# EAGLE design lm25010 (EAGLE 8.1.0)
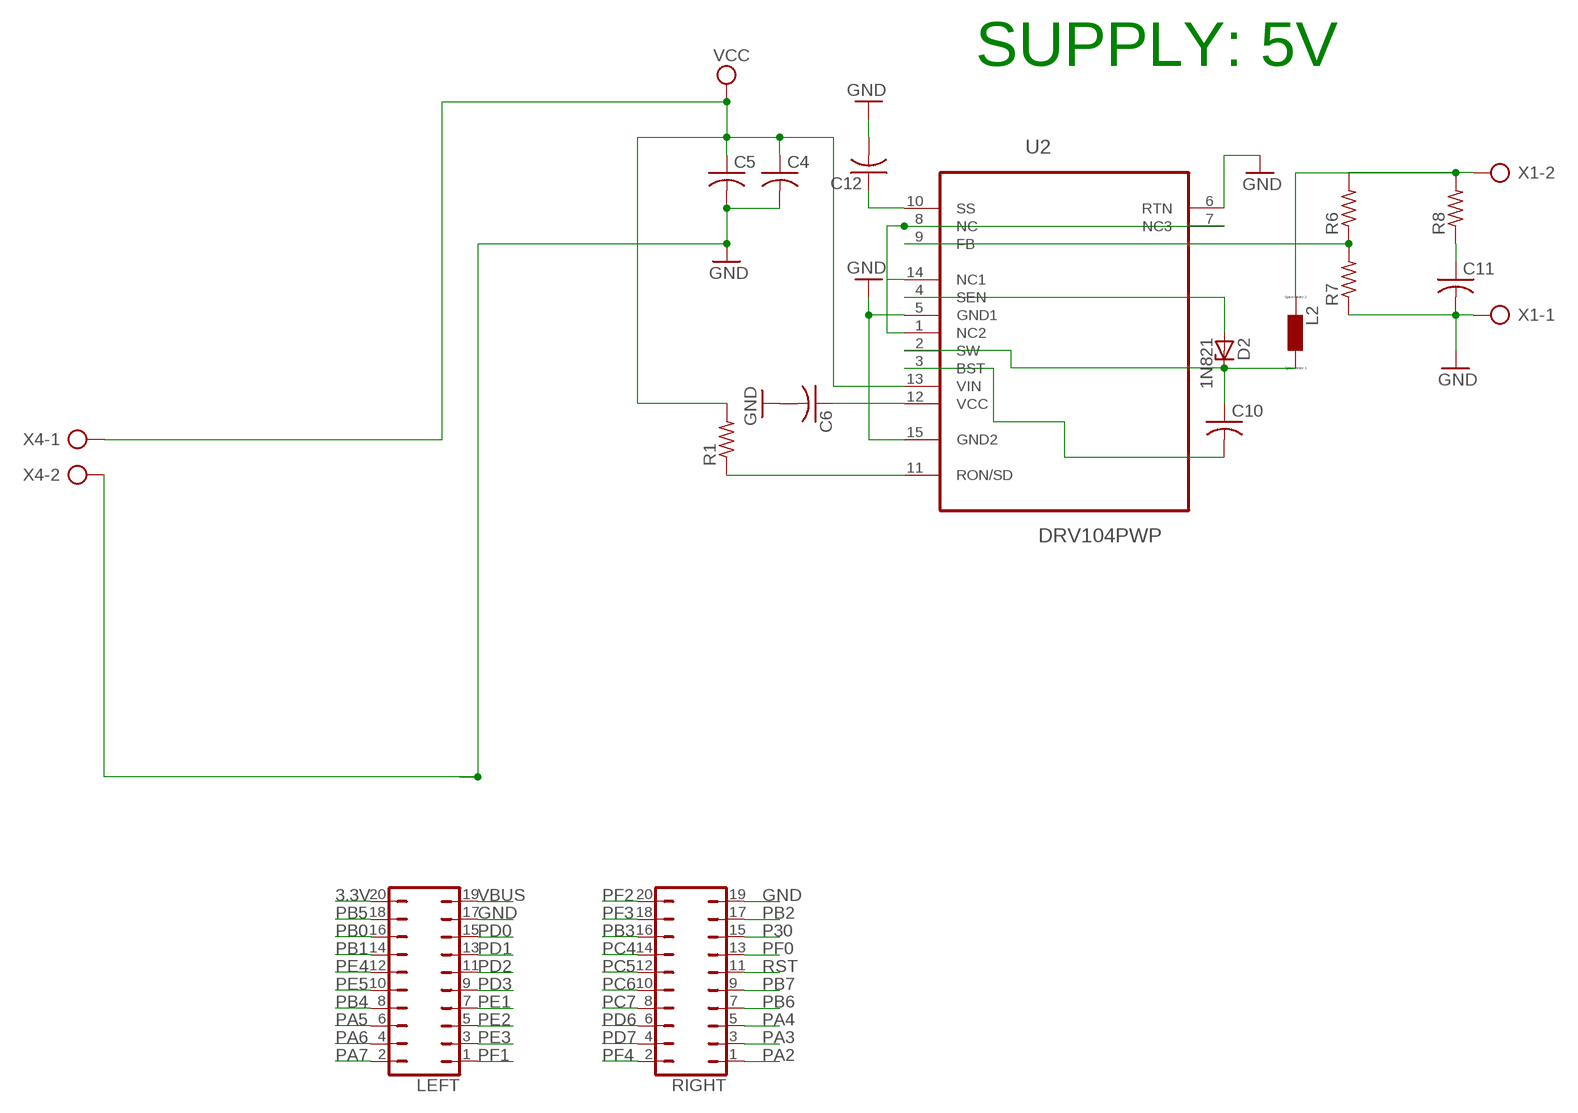
[diagram p0: schematic, sheet 1]

## Parts
C4  C-US025-024X044  [C025-024X044]
C5  C-US025-024X044  [C025-024X044]
C6  C-US025-024X044  [C025-024X044]
C10  C-US025-024X044  [C025-024X044]
C11  C-US025-024X044  [C025-024X044]
C12  C-US025-024X044  [C025-024X044]
D2  1N821  [DO35Z10]
L2  L0207/10  [0207/10]
LEFT  JP10Q  [JP10Q]
R1  R-US_0207/10  [0207/10]
R6  R-US_0207/10  [0207/10]
R7  R-US_0207/10  [0207/10]
R8  R-US_0207/10  [0207/10]
RIGHT  JP10Q  [JP10Q]
U2  DRV104PWP  [SOP65P640X120-15N]
X1  AK300/2  [AK300/2]
X4  AK300/2  [AK300/2]

## Nets
3.3V: LEFT.20
GND: C4.2 C5.2 C6.2 C11.2 C12.2 LEFT.17 R7.1 RIGHT.19 U2.5(GND1) U2.6(RTN) U2.15(GND2) X1.1 X4.2
N$1: U2.1(NC2) U2.7(NC3) U2.8(NC) U2.14(NC1)
N$5: R1.1 U2.11(RON/SD)
N$11: C12.1 U2.10(SS)
N$15: C6.1 U2.12(VCC)
N$17: C11.1 R8.1
N$18: L2.2 R6.2 R8.2 X1.2
N$19: R6.1 R7.2 U2.9(FB)
N$20: D2.A U2.4(SEN)
N$21: C10.1 D2.C L2.1 U2.2(SW)
N$22: C10.2 U2.3(BST)
P30: RIGHT.15
PA2: RIGHT.1
PA3: RIGHT.3
PA4: RIGHT.5
PA5: LEFT.6
PA6: LEFT.4
PA7: LEFT.2
PB0: LEFT.16
PB1: LEFT.14
PB2: RIGHT.17
PB3: RIGHT.16
PB4: LEFT.8
PB5: LEFT.18
PB6: RIGHT.7
PB7: RIGHT.9
PC4: RIGHT.14
PC5: RIGHT.12
PC6: RIGHT.10
PC7: RIGHT.8
PD0: LEFT.15
PD1: LEFT.13
PD2: LEFT.11
PD3: LEFT.9
PD6: RIGHT.6
PD7: RIGHT.4
PE1: LEFT.7
PE2: LEFT.5
PE3: LEFT.3
PE4: LEFT.12
PE5: LEFT.10
PF0: RIGHT.13
PF1: LEFT.1
PF2: RIGHT.20
PF3: RIGHT.18
PF4: RIGHT.2
RST: RIGHT.11
VBUS: LEFT.19
VCC: C4.1 C5.1 R1.2 U2.13(VIN) X4.1

## Notes on the sheet
- SUPPLY: 5V

## Library data of the parts
C4-C6 C10-C12 = rcl:C-US: CAPACITOR, American symbol
D2 = diode:1N821: Reference DIODE temperature compensated, 6,2 V
L2 = eagle-ltspice:L: INDUCTOR, European symbol; SPICEMODEL: NONE; SPICEPREFIX: L
LEFT RIGHT = jumper:JP10Q: JUMPER
R1 R6-R8 = rcl:R-US_: RESISTOR, American symbol
U2 = Texas Instruments_By_element14_Batch_1:DRV104PWP: High-Side Driver for Solenoids,Coils, Valves, Heaters, and Lamps; MPN: DRV104PWP; OC_FARNELL: -; OC_NEWARK: 01J0534; PACKAGE: HTSSOP-14; SUPPLIER: Texas Instruments
X1 X4 = con-ptr500:AK300/2: CONNECTOR; OC_FARNELL: unknown; OC_NEWARK: unknown

## Board
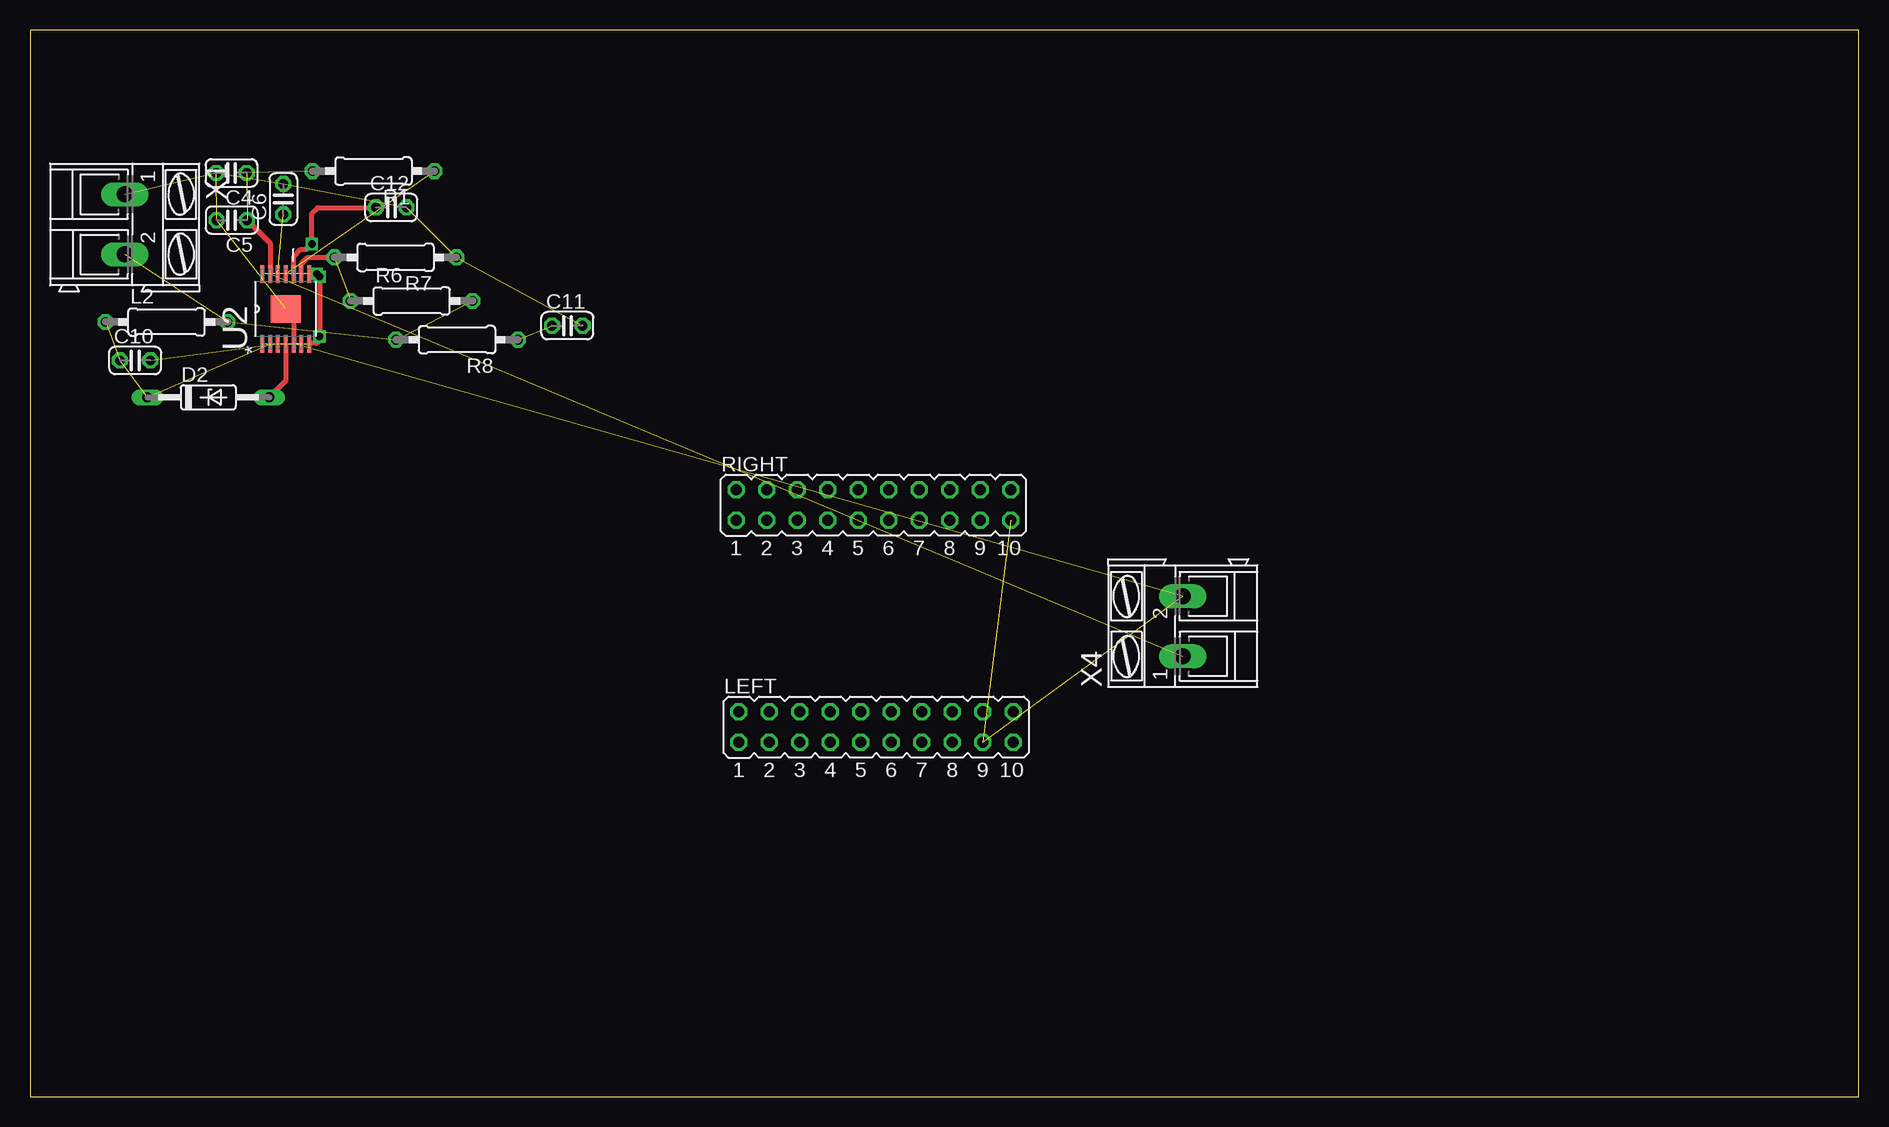
[diagram p1: board, top side]
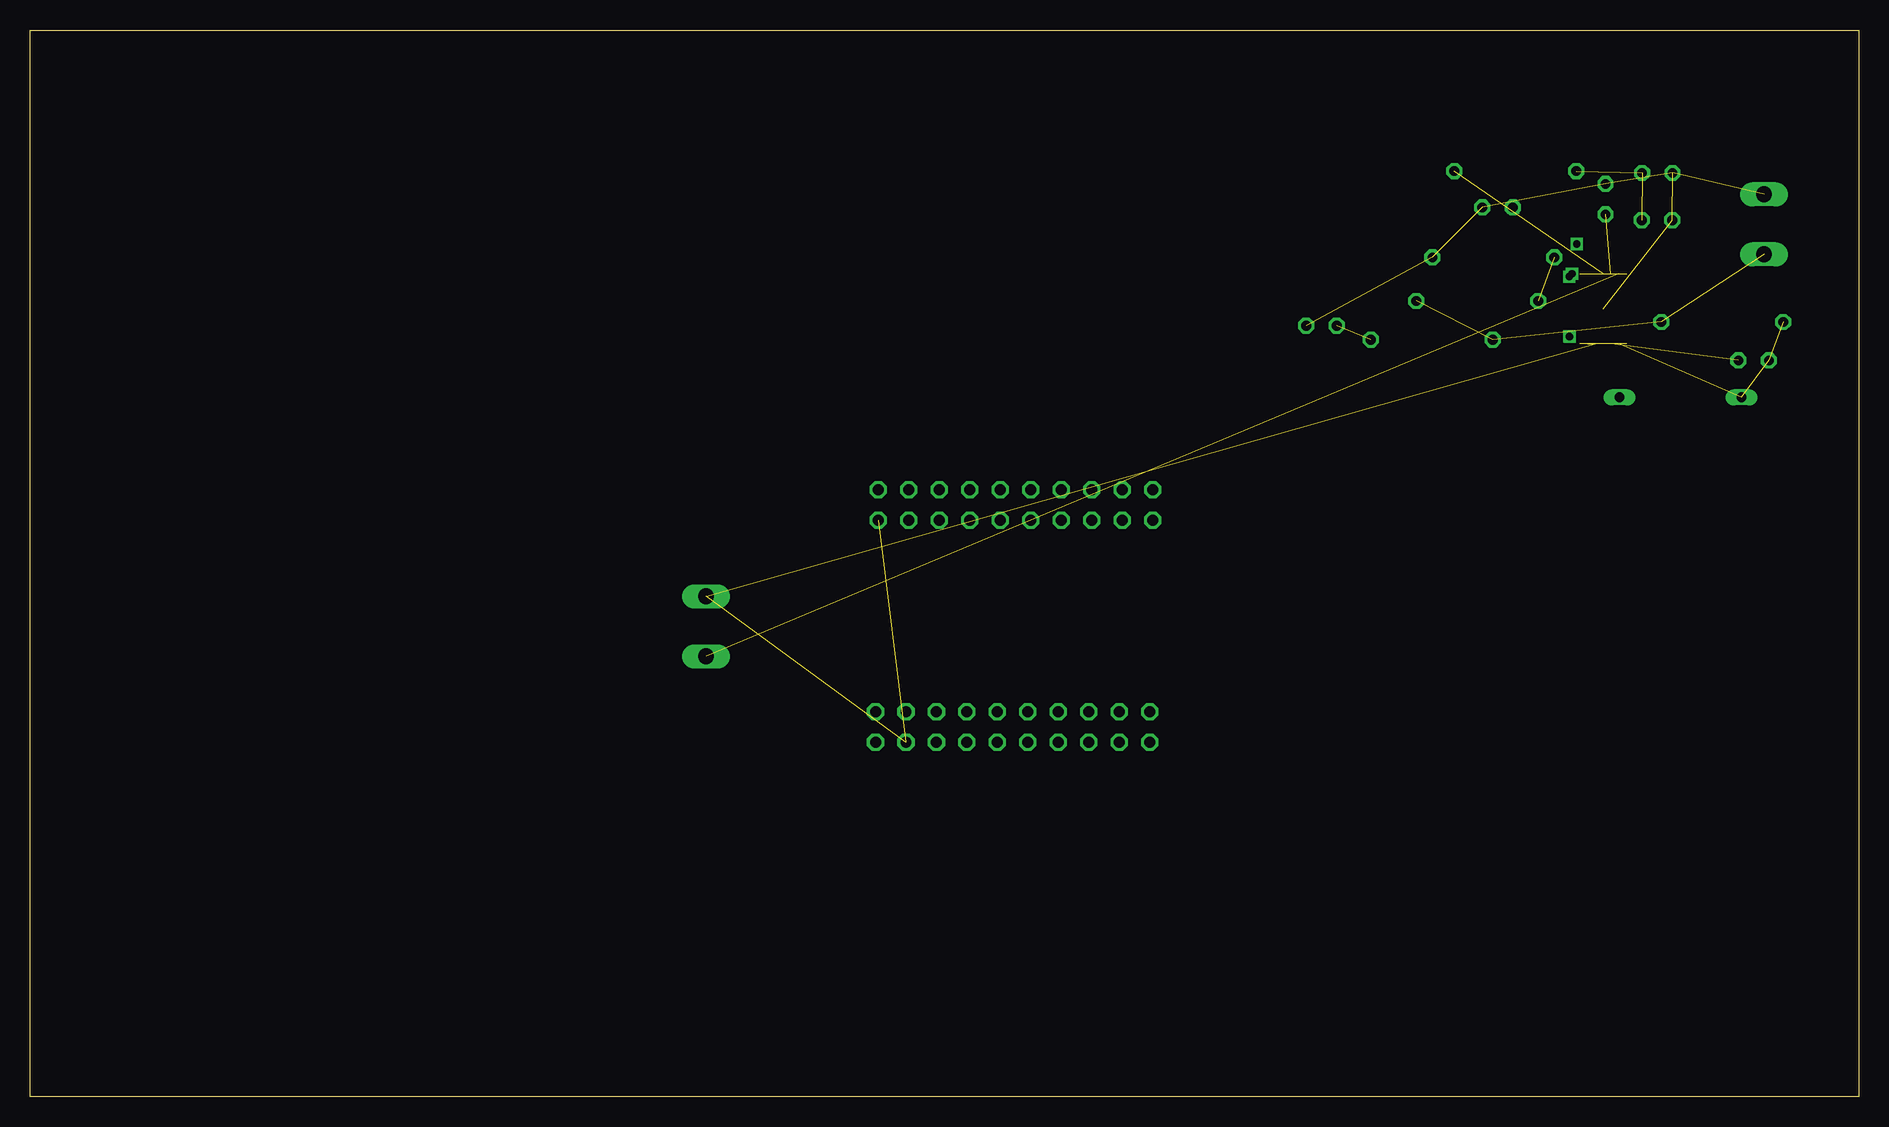
[diagram p2: board, bottom side, seen from below]

Size 152.4 x 88.9 mm. Coordinates in mm from the lower left corner, seen from the top.
Outline: 0,0 152.4,0 152.4,88.9 0,88.9 0,0
Copper layers (1*16): Top 0.035mm / dielectric 1.5mm / Bottom 0.035mm
Design rules "default": minimum track width 10mil, minimum drill 24mil, track to track 8mil, track to pad 8mil, pad to pad 8mil, via to via 8mil, smd to smd 8mil, copper to edge 40mil, drill to drill 8mil, minimum pad ring 10mil, minimum via ring 8mil, stop-mask expansion 4mil, vias tented up to drill 0mil, thermal gap 10mil

### Footprints (pad centres in the part's own frame; a part is rotated, then mirrored left to right if it is on the bottom)
C025-024X044 = drill 0.813 octagon: 1 -1.27,0; 2 1.27,0
DO35Z10 = drill 0.813 long: A 5.08,0; C -5.08,0
0207/10 = drill 0.813 octagon: 1 -5.08,0; 2 5.08,0
JP10Q = drill 0.914 octagon: 1 -11.43,-1.27; 2 -11.43,1.27; 3 -8.89,-1.27; 4 -8.89,1.27; 5 -6.35,-1.27; 6 -6.35,1.27; 7 -3.81,-1.27; 8 -3.81,1.27; 9 -1.27,-1.27; 10 -1.27,1.27; 11 1.27,-1.27; 12 1.27,1.27; 13 3.81,-1.27; 14 3.81,1.27; 15 6.35,-1.27; 16 6.35,1.27; 17 8.89,-1.27; 18 8.89,1.27; 19 11.43,-1.27; 20 11.43,1.27
SOP65P640X120-15N = smd 1.473 x 0.356: 1 -2.921,1.956; 2 -2.921,1.295; 3 -2.921,0.66; 4 -2.921,0; 5 -2.921,-0.66; 6 -2.921,-1.295; 7 -2.921,-1.956; 8 2.921,-1.956; 9 2.921,-1.295; 10 2.921,-0.66; 11 2.921,0; 12 2.921,0.66; 13 2.921,1.295; 14 2.921,1.956 | smd 2.311 x 2.464: 15 0,0
AK300/2 = drill 1.321 long: 1 -2.515,0; 2 2.489,0

### Placement (x,y rotation side)
C4  16.79,76.99 180 top
C5  16.81,73.05 180 top
C6  21.11,74.8 90 top
C10  8.76,61.37 0 top
C11  44.78,64.26 0 top
C12  30.1,74.12 0 top
D2  14.86,58.29 0 top
L2  11.38,64.57 0 top
LEFT  70.51,30.81 0 top
R1  28.63,77.14 180 top
R6  31.8,66.32 0 top
R7  30.45,69.95 180 top
R8  35.59,63.09 180 top
RIGHT  70.28,49.3 0 top
U2  21.31,65.66 90 top
X1  7.9,72.69 270 top
X4  96.06,39.22 90 top

### Tracks (layer width: path | path; a pad name or v marks a point on that pad's centre or on a via)
GND  (11 unrouted)
  Top 0.406: U2.15 21.97,65 U2.5
N$1  (via drill 0.6)  (2 unrouted)
  Top 0.406: U2.8 v23.9,68.58 | v24.13,68.35 v24.13,63.37 | v24.11,63.35 24.11,63.02 23.88,62.79 23.32,62.79 U2.7
  Bottom 0.406: v23.9,68.58 v24.13,68.35 | v24.13,63.37 v24.11,63.35
N$5  (1 unrouted)
N$11  (via drill 0.6)
  Top 0.406: U2.10 21.97,70 22.58,70.61 23.04,70.61 v23.5,71.07 23.5,73.61 23.98,74.09 v28.8,74.09
  Bottom 0.406: v28.8,74.09 C12.1
N$15  (1 unrouted)
N$17  (1 unrouted)
N$18  (3 unrouted)
N$19  (1 unrouted)
  Top 0.406: U2.9 22.61,69.42 23.14,69.95 R7.2
N$20
  Top 0.406: U2.4 21.31,59.66 D2.A
N$21  (3 unrouted)
  Bottom 0.406: 6.22,64.64 L2.1
N$22  (1 unrouted)
  Bottom 0.406: 10.06,61.39 C10.2
VCC  (3 unrouted)
  Top 0.406: C5.1 20.02,71.12 U2.13